# Altium schematic sheet BOOSTXL-K350QVG-S1.SchDoc
size A4; PageSetup: Record=PageOptions|CenterHorizontal=True|CenterVertical=True|PrintScale=1.00|XCorrection=1.00|YCorrection=1.00|PrintKind=1|BorderSize=5000000|LeftOffset=0|BottomOffset=0|Orientation=2|PaperLength=1000|PaperWidth=1000|Scale=100|PaperSource=15|PrintQuality=1200|MediaType=1|DitherType=10|PaperKind=A4|PrintScaleMode=1
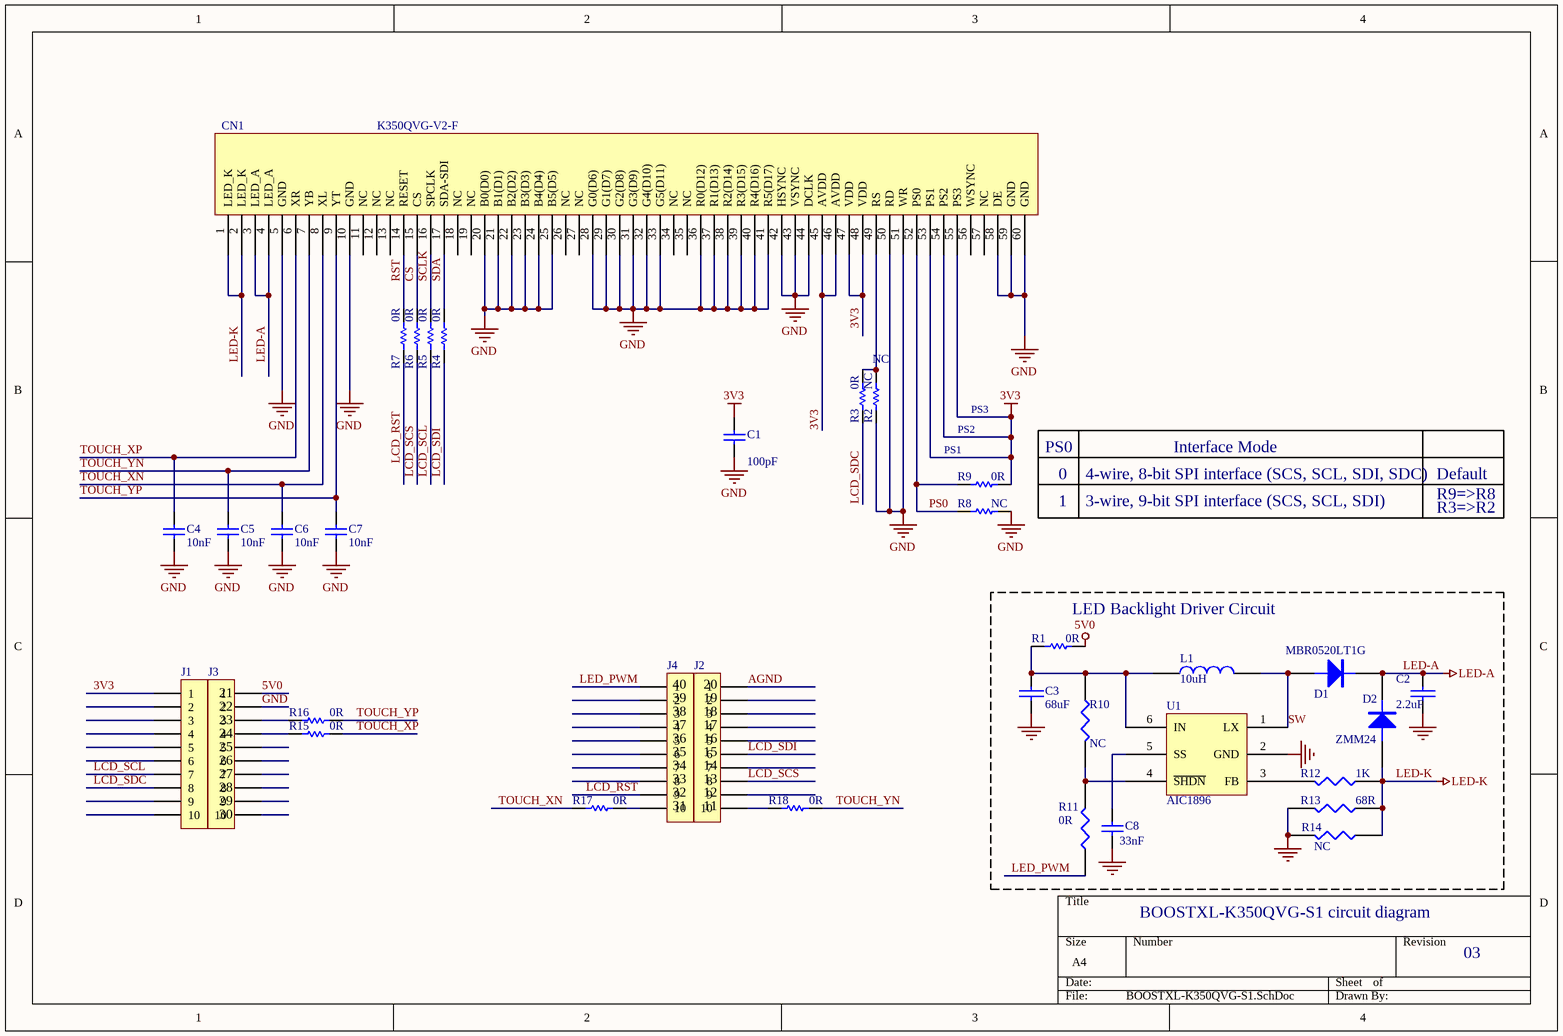
[diagram p0: BOOSTXL-K350QVG-S1.SchDoc]

## Parts
C1  value 100pF  [1608[0603]]  (hidden comment: 0.1uF)
C2  2.2uF  [3225[1210]]
C3  68uF  [TAN-C]
C4  10nF  [1608[0603]]
C5  10nF  [1608[0603]]
C6  10nF  [1608[0603]]
C7  10nF  [1608[0603]]
C8  33nF  [1608[0603]]
CN1  K350QVG-V2-F  [CON-K350-60]
D1  MBR0520LT1G  [DIODE]
D2  ZMM24  [DIODE]
J1  Socket 10  [HDR1X10]  (value not drawn)
J2  Socket 10  [HDR1X10]  (value not drawn)
J3  Socket 10  [HDR1X10]  (value not drawn)
J4  Socket 10  [HDR1X10]  (value not drawn)
L1  10uH  [IND]
R1  0R  [1608[0603]]
R2  NC  [1608[0603]]
R3  0R  [1608[0603]]
R4  0R  [1608[0603]]
R5  0R  [1608[0603]]
R6  0R  [1608[0603]]
R7  0R  [1608[0603]]
R8  NC  [1608[0603]]
R9  0R  [1608[0603]]
R10  NC  [1608[0603]]
R11  0R  [1608[0603]]
R12  1K  [1608[0603]]
R13  68R  [1608[0603]]
R14  NC  [1608[0603]]
R15  0R  [1608[0603]]
R16  0R  [1608[0603]]
R17  0R  [1608[0603]]
R18  0R  [1608[0603]]
U1  AIC1896  [SOT-23-6]

## Blocks framed on the sheet
LED Backlight Driver Circuit: C2 C3 C8 D1 D2 L1 R1 R10-R14 U1

## Nets
3V3: C1.2 CN1.45(AVDD) CN1.46(AVDD) CN1.47(VDD) CN1.48(VDD) CN1.53(PS1) CN1.54(PS2) CN1.55(PS3) J1.1 R9.2
5V0: J3.1 R1.2
AGND: C2.1 C3.2 C8.1 J2.1 R13.2 R14.2
GND: C1.1 C4.1 C5.1 C6.1 C7.1 CN1.5(GND) CN1.10(GND) CN1.20(B0(D0)) CN1.21(B1(D1)) CN1.22(B2(D2)) CN1.23(B3(D3)) CN1.24(B4(D4)) CN1.25(B5(D5)) CN1.28(G0(D6)) CN1.29(G1(D7)) CN1.30(G2(D8)) CN1.31(G3(D9)) CN1.32(G4(D10)) CN1.33(G5(D11)) CN1.36(R0(D12)) CN1.37(R1(D13)) CN1.38(R2(D14)) CN1.39(R3(D15)) CN1.40(R4(D16)) CN1.41(R5(D17)) CN1.42(HSYNC) CN1.43(VSYNC) CN1.44(DCLK) CN1.50(RD) CN1.51(WR) CN1.58(DE) CN1.59(GND) CN1.60(GND) J3.2 R2.1 R8.2 U1.2(GND)
LED-A: C2.2 CN1.3(LED_A) CN1.4(LED_A) D1.K D2.K
LED-K: CN1.1(LED_K) CN1.2(LED_K) D2.A R12.1 R13.1 R14.1
CS: CN1.15(CS) R6.2
LCD_RST: J4.9 R7.1
LCD_SCL: J1.7 R5.1
LCD_SCS: J2.8 R6.1
LCD_SDC: J1.8 R3.1
LCD_SDI: J2.6 R4.1
LED_PWM: J4.1 R11.1
PS0: CN1.52(PS0) R8.1 R9.1
RST: CN1.14(RESET) R7.2
SCLK: CN1.16(SPCLK) R5.2
SDA: CN1.17(SDA-SDI) R4.2
SW: D1.A L1.2 U1.1(LX)
TOUCH_XN: C6.2 CN1.8(XL) R17.1
TOUCH_XP: C4.2 CN1.6(XR) R15.2
TOUCH_YN: C5.2 CN1.7(YB) R18.2
TOUCH_YP: C7.2 CN1.9(YT) R16.2
NetC3_1: C3.1 L1.1 R1.1 R10.1 U1.6(IN)
NetC8_2: C8.2 U1.5(SS)
NetCN1_49: CN1.49(RS) R2.2 R3.2
NetJ2_10: J2.10 R18.1
NetJ3_3: J3.3 R16.1
NetJ3_4: J3.4 R15.1
NetJ4_10: J4.10 R17.2
NetR10_2: R10.2 R11.2 U1.4(~{SHDN})
NetR12_2: R12.2 U1.3(FB)

Not connected (* = marked no-connect by the designer): CN1 11(NC) 12(NC) 13(NC) 18(NC) 19(NC) 26(NC) 27(NC) 34(NC) 35(NC) 56(WSYNC) 57(NC); J1 2 3 4 5 6 9 10; J2 2 3 4 5 7 9; J3 5 6 7 8 9 10; J4 2 3 4 5 6 7 8

## Notes on the sheet
- PS2
- PS3
- (near R9) PS1
- PS0
- 0
- 1
- 3-wire, 9-bit SPI interface (SCS, SCL, SDI)
- 4-wire, 8-bit SPI interface (SCS, SCL, SDI, SDC)
- Interface Mode
- Default
- R9=>R8
- R3=>R2
- (near J3) 21
- (near J3) 22
- (near J4) 38
- (near J4) 39
- (near J4) 40
- (near J2) 18
- (near J2) 19
- (near J2) 20
- (near J3) 23
- (near J3) 24
- (near J3) 25
- (near J3) 26
- (near J3) 27
- (near J4) 33
- (near J4) 34
- (near J4) 35
- (near J4) 36
- (near J4) 37
- (near J2) 13
- (near J2) 14
- (near J2) 15
- (near J2) 16
- (near J2) 17
- (near J3) 28
- (near J3) 29
- (near J3) 30
- (near J4) 31
- (near J4) 32
- (near J2) 11
- (near J2) 12
- BOOSTXL-K350QVG-S1 circuit diagram
- 03

## Library data of the parts
C1 C4-C7 = Cap Semi: Capacitor (Semiconductor SIM Model); Published: 8-Jun-2000; LatestRevisionDate: 17-Jul-2002; LatestRevisionNote: Re-released for DXP Platform.; PackageReference: C1206; Publisher: Altium Limited
  C4-C7: Value: 10nF
C2 C3 = CAP: Capacitor
C8 = Cap Semi: Capacitor (Semiconductor SIM Model); Value: 0.033uF; Published: 8-Jun-2000; LatestRevisionDate: 17-Jul-2002; LatestRevisionNote: Re-released for DXP Platform.; PackageReference: C1206; Publisher: Altium Limited
CN1 = K350QVG
D1 D2 = DIODE
J1-J4 = Header 10: Header, 10-Pin; LatestRevisionDate: 17-Jul-2002; LatestRevisionNote: Re-released for DXP Platform.; Publisher: Altium Limited
L1 = INDUCTOR
R1-R9 R15-R18 = Res Semi: Semiconductor Resistor; Published: 8-Jun-2000; LatestRevisionDate: 17-Jul-2002; LatestRevisionNote: Re-released for DXP Platform.; PackageReference: AXIAL-0.5; Publisher: Altium Limited
  R1 R3-R7 R9 R15-R18: Value: 0R
  R2 R8: Value: NC
R10-R14 = RES1